# Altium schematic sheet Seperation_Switches.SchDoc
size 297 x 209 mm; SheetNumber: 3; SheetTotal: 3
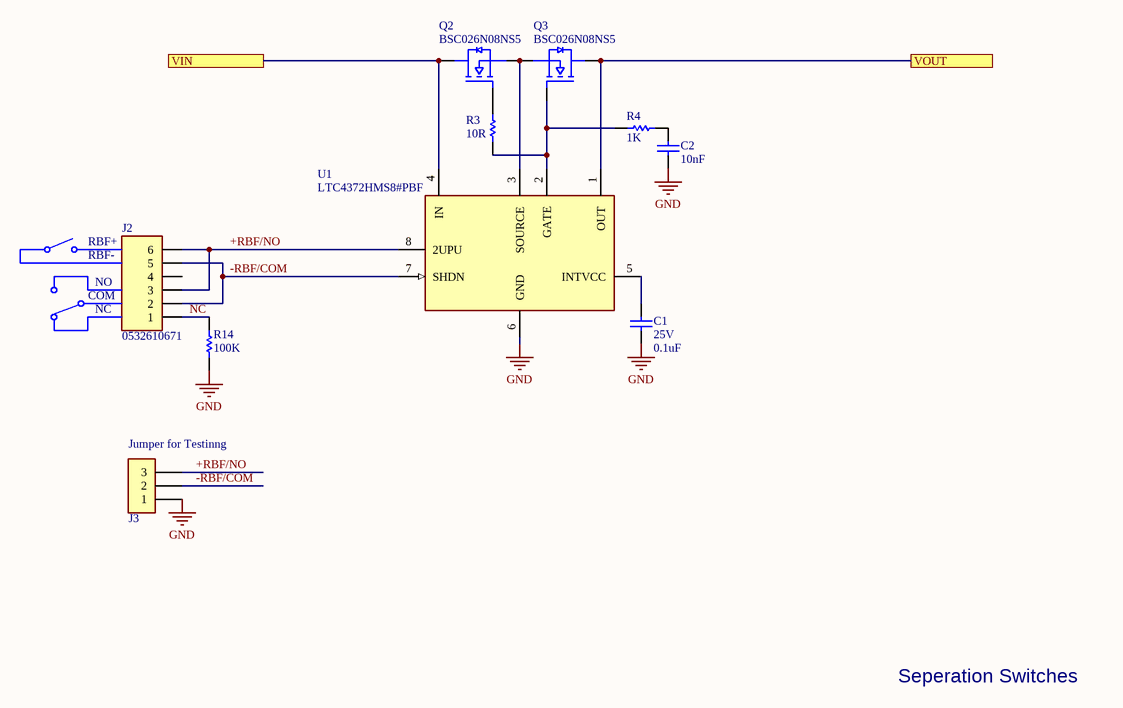
[diagram p0: Seperation_Switches.SchDoc]

## Parts
C1  Voltage Rating: 25V  Capacitance: 0.1uF  [CAPC0805X060]  (hidden comment: CL21B104KACNNNC)
C2  Capacitance: 10nF  [CAPC0805X060]  (hidden comment: CL21B103KBANNNC)
J2  0532610671  [0532610671]
J3  61300311121  [61300311121]  (value not drawn)
Q2  BSC026N08NS5  [PG-TDSON-8-5]
Q3  BSC026N08NS5  [PG-TDSON-8-5]
R3  Resistance: 10R  [RESC0603]  (hidden comment: RMCF0603FT10R0)
R4  Resistance: 1K  [RESC0805]  (hidden comment: RNCP0805FTD1K00)
R14  Resistance: 100K  [RESC0603]  (hidden comment: RMCF0603FT100K)
U1  LTC4372HMS8#PBF  [MS8-8LEAD]

## Ports
VIN (see Power_Path[6C]), VOUT (see Power_Path[5C])

## Nets
GND: C1.1 C2.1 J3.1 R14.1 U1.6(GND)
+RBF/NO: J2.3 J2.6 J3.3 U1.8(2UPU)
-RBF/COM: J2.2 J2.5 J3.2 U1.7(SHDN)
NC: J2.1 R14.2
VIN: Q2.D U1.4(IN) ; port VIN
VOUT: Q3.D U1.1(OUT) ; port VOUT
NetC1_2: C1.2 U1.5(INTVCC)
NetC2_2: C2.2 R4.1
NetQ2_G: Q2.G R3.2
NetQ2_S: Q2.S Q3.S U1.3(SOURCE)
NetQ3_G: Q3.G R3.1 R4.2 U1.2(GATE)

Not connected (* = marked no-connect by the designer): J2 4

## Notes on the sheet
- (near J2) RBF+
- (near J2) RBF-
- COM
- NC
- NO
- (near J3) Jumper for Testinng
- Seperation Switches
- Size:
- Title:
- A4
- Project:
- Rev:
- Date:
- Drawn By:
- Sheet:
- of

## Library data of the parts
C1 = CL21B104KACNNNC: 0.1uF ±10% 25V Ceramic Capacitor X7R 0805 (2012 Metric); Manufacturer Part Number: CL21B104KACNNNC; Distributor Part Number: 1276-1099-1-ND; Tolerance: 10%; Case Code: 0805; Distributor: Digikey
C2 = CL21B103KBANNNC: 10nF ±10% 50V Ceramic Capacitor X7R 0805 (2012 Metric); Voltage Rating: 25V; Manufacturer Part Number: CL21B103KBANNNC; Distributor Part Number: 1276-1015-1-ND; Tolerance: 10%; Case Code: 0805; Distributor: Digikey
J2 = 0532610671: Connector Header Surface Mount, Right Angle 6 position 0.049" (1.25mm) Picoblade; Number of Positions: 6; Contact Current (Max): 1A; Material Flammability Rating: UL94 V-0; Part Number: 0532610671; Distributor Part Number: WM7624CT-ND; Distributor: Digikey
J3 = 61300311121: Header 2.54mm, 1x3 Position; Rows: 1; Positions: 3; Current Rating (A): 3A; Manufacturer Part Number: 61300311121; Distributor Part Number: 732-5316-ND; Operating Temperature: -40°C ~ 105°C
Q2 Q3 = BSC026N08NS5: 80V N-Channel 23A (Ta), 100A (Tc) 2.5W (Ta), 156W (Tc) Surface Mount PG-TDSON-8-6; Vgs (Max): 20; Vds (Max): 4; Qg: 92nC@10V; Vth: 3.8V; Id: 23; Power Dissipation: 3.1W; Drive Voltage: 6V~10V; Rds On (Max) @ Id, Vgs: 2.6mOhm @ 50A, 10V; Manufacturer Part Number: BSC026N08NS5; Distributor Part Number: BSC026N08NS5ATMA1CT-ND; Distributor: Digikey; Operating Temperature: -55°C ~ 150°C (TJ); Power Dissipation (Max): 2.5W (Ta), 156W (Tc)
R3 = RMCF0603FT10R0: 10 Ohms ±1% 0.1W, 1/10W Chip Resistor 0603 (1608 Metric) Automotive AEC-Q200 Thick Film; Manufacturer Part Number: RMCF0603FT10R0; Tolerance: 1%; Distributor: Digikey; Distributor Part Number: RMCF0603FT10R0CT-ND; Case Code: 0603
R4 = RNCP0805FTD1K00: 1 kOhms ±1% 0.25W, 1/4W Chip Resistor 0805 (2012 Metric) Anti-Sulfur Thin Film; Manufacturer Part Number: RNCP0805FTD1K00; Tolerance: 1%; Distributor Part Number: RNCP0805FTD1K00CT-ND; Distributor: Digikey; Case Code: 0805
R14 = RMCF0603FT100K: 100 kOhms ±1% 0.1W, 1/10W Chip Resistor 0603 (1608 Metric) Automotive AEC-Q200 Thick Film; Part Number: RMCF0603FT100K; Tolerance: 1%; Distributor: Digikey; Distributor Part Number: RMCF0603FT100KCT-ND; Case Code: 0603
U1 = LTC4372HMS8#PBF: Ideal Diode Controller, 8-lead MSOP SHDN; Manufacturer Part Number: LTC4373CMS8#PBF; Qualification: None; Voltage Supply: 2.5V ~ 80V; Distributor Part Number: 505-LTC4372HMS8#PBF-ND; Package: 8-Lead MSOP; Distributor: Digikey; Operating Temperature: -40°C ~ 125°C (TA)